# EAGLE design paintboard (EAGLE 6.4)
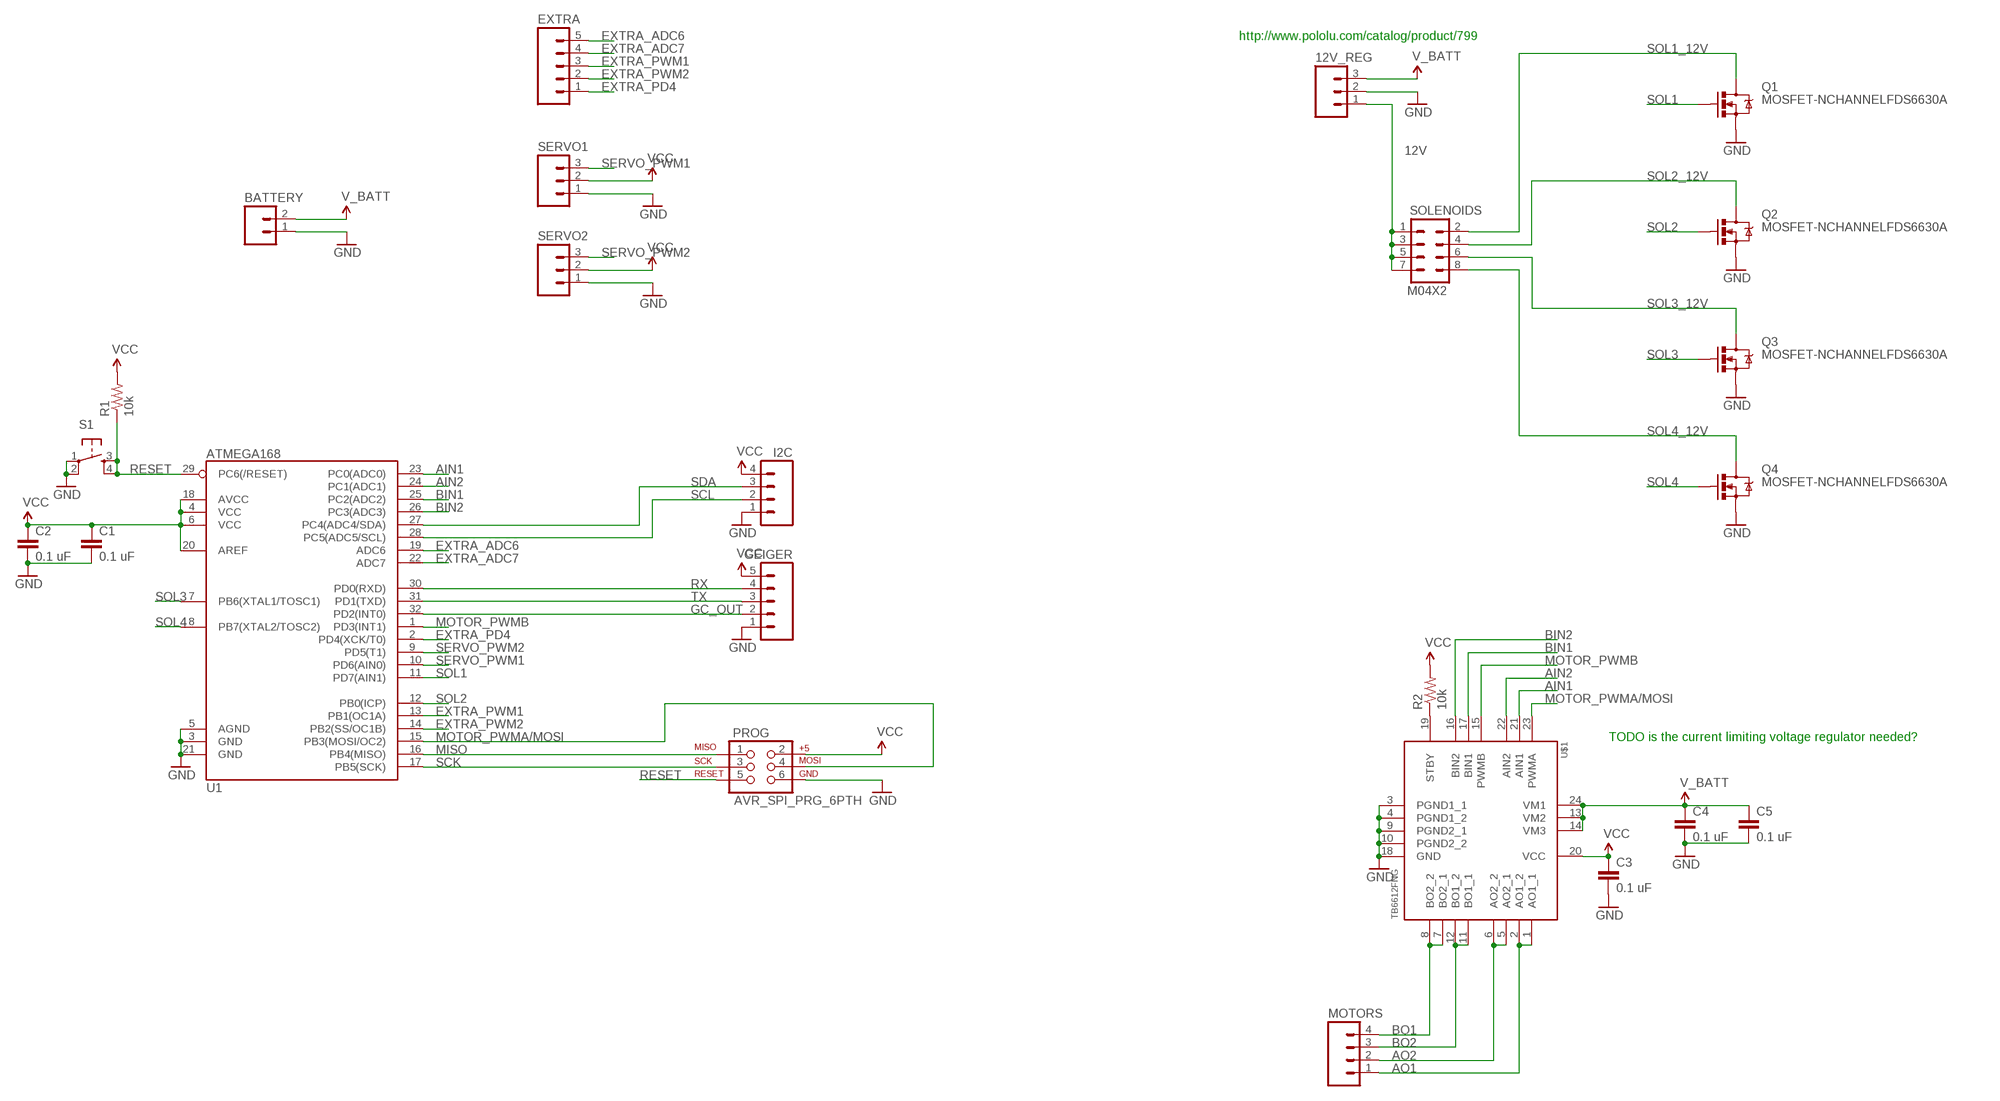
[diagram p0: schematic, sheet 1]

## Parts
12V_REG  M03PTH  [1X03]
BATTERY  M02PTH  [1X02]
C1  0.1 uF  CAP0805  [0805]
C2  0.1 uF  CAP0805  [0805]
C3  0.1 uF  CAP0805  [0805]
C4  0.1 uF  CAP0805  [0805]
C5  0.1 uF  CAP0805  [0805]
EXTRA  M05PTH  [1X05]
GEIGER  M05PTH  [1X05]
I2C  M04PTH  [1X04]
MOTORS  M04PTH  [1X04]
PROG  AVR_SPI_PRG_6PTH  [2X3]
Q1  MOSFET-NCHANNELFDS6630A  [SO08]
Q2  MOSFET-NCHANNELFDS6630A  [SO08]
Q3  MOSFET-NCHANNELFDS6630A  [SO08]
Q4  MOSFET-NCHANNELFDS6630A  [SO08]
R1  10k  RESISTOR0805-RES  [0805]
R2  10k  RESISTOR0805-RES  [0805]
S1  TAC_SWITCHSMD  [TACTILE_SWITCH_SMD]
SERVO1  M03PTH  [1X03]
SERVO2  M03PTH  [1X03]
SOLENOIDS  M04X2  [2X4]
U1  ATMEGA168  [TQFP32-08]
U$1  TB6612FNG  [24-SSOP]

## Nets
12V: 12V_REG.1 SOLENOIDS.1 SOLENOIDS.3 SOLENOIDS.5 SOLENOIDS.7
AIN1: U1.23(PC0(ADC0)) U$1.21(AIN1)
AIN2: U1.24(PC1(ADC1)) U$1.22(AIN2)
AO1: MOTORS.1 U$1.1(AO1_1) U$1.2(AO1_2)
AO2: MOTORS.2 U$1.5(AO2_1) U$1.6(AO2_2)
BIN1: U1.25(PC2(ADC2)) U$1.17(BIN1)
BIN2: U1.26(PC3(ADC3)) U$1.16(BIN2)
BO1: MOTORS.4 U$1.7(BO2_1) U$1.8(BO2_2)
BO2: MOTORS.3 U$1.11(BO1_1) U$1.12(BO1_2)
EXTRA_ADC6: EXTRA.5 U1.19(ADC6)
EXTRA_ADC7: EXTRA.4 U1.22(ADC7)
EXTRA_PD4: EXTRA.1 U1.2(PD4(XCK/T0))
EXTRA_PWM1: EXTRA.3 U1.13(PB1(OC1A))
EXTRA_PWM2: EXTRA.2 U1.14(PB2(SS/OC1B))
GC_OUT: GEIGER.2 U1.32(PD2(INT0))
GND: 12V_REG.2 BATTERY.1 C1.2 C2.2 C3.2 C4.2 C5.2 GEIGER.1 I2C.1 PROG.6 Q1.1(S) Q1.2(S) Q1.3(S) Q2.1(S) Q2.2(S) Q2.3(S) Q3.1(S) Q3.2(S) Q3.3(S) Q4.1(S) Q4.2(S) Q4.3(S) S1.1 S1.2 SERVO1.1 SERVO2.1 U1.3(GND) U1.5(AGND) U1.21(GND) U$1.3(PGND1_1) U$1.4(PGND1_2) U$1.9(PGND2_1) U$1.10(PGND2_2) U$1.18(GND)
MISO: PROG.1 U1.16(PB4(MISO))
MOTOR_PWMA/MOSI: PROG.4 U1.15(PB3(MOSI/OC2)) U$1.23(PWMA)
MOTOR_PWMB: U1.1(PD3(INT1)) U$1.15(PWMB)
N$4: R2.1 U$1.19(STBY)
RESET: PROG.5 R1.1 S1.3 S1.4 U1.29(PC6(/RESET))
RX: GEIGER.4 U1.30(PD0(RXD))
SCK: PROG.3 U1.17(PB5(SCK))
SCL: I2C.2 U1.28(PC5(ADC5/SCL))
SDA: I2C.3 U1.27(PC4(ADC4/SDA))
SERVO_PWM1: SERVO1.3 U1.10(PD6(AIN0))
SERVO_PWM2: SERVO2.3 U1.9(PD5(T1))
SOL1: Q1.4(G) U1.11(PD7(AIN1))
SOL1_12V: Q1.5(D) Q1.6(D) Q1.7(D) Q1.8(D) SOLENOIDS.2
SOL2: Q2.4(G) U1.12(PB0(ICP))
SOL2_12V: Q2.5(D) Q2.6(D) Q2.7(D) Q2.8(D) SOLENOIDS.4
SOL3: Q3.4(G) U1.7(PB6(XTAL1/TOSC1))
SOL3_12V: Q3.5(D) Q3.6(D) Q3.7(D) Q3.8(D) SOLENOIDS.6
SOL4: Q4.4(G) U1.8(PB7(XTAL2/TOSC2))
SOL4_12V: Q4.5(D) Q4.6(D) Q4.7(D) Q4.8(D) SOLENOIDS.8
TX: GEIGER.3 U1.31(PD1(TXD))
V_BATT: 12V_REG.3 BATTERY.2 C4.1 C5.1 U$1.13(VM2) U$1.14(VM3) U$1.24(VM1)
VCC: C1.1 C2.1 C3.1 GEIGER.5 I2C.4 PROG.2 R1.2 R2.2 SERVO1.2 SERVO2.2 U1.4(VCC) U1.6(VCC) U1.18(AVCC) U1.20(AREF) U$1.20(VCC)

## Notes on the sheet
- http://www.pololu.com/catalog/product/799
- TODO is the current limiting voltage regulator needed?

## Library data of the parts
12V_REG SERVO1 SERVO2 = SparkFun-Connectors:M03: Header 3 Standard 3-pin 0.1" header. Use with straight break away headers (SKU : PRT-00116), right angle break away headers (PRT-00553), swiss pins (PRT-00743), machine pins (PRT-00117), and female headers (PRT-00115). Molex polarized connector foot print use with SKU : PRT-08232 with associated crimp pins and housings.
BATTERY = SparkFun-Connectors:M02: Header 2 Standard 2-pin 0.1" header. Use with straight break away headers (SKU : PRT-00116), right angle break away headers (PRT-00553), swiss pins (PRT-00743), machine pins (PRT-00117), and female headers (PRT-00115). Molex polarized connector foot print use with SKU : PRT-08233 with associated crimp pins and housings.
C1-C5 = SparkFun-Passives:CAP: Capacitor Standard 0603 ceramic capacitor, and 0.1" leaded capacitor.
EXTRA GEIGER = SparkFun-Connectors:M05: Header 5 Standard 5-pin 0.1" header. Use with straight break away headers (SKU : PRT-00116), right angle break away headers (PRT-00553), swiss pins (PRT-00743), machine pins (PRT-00117), and female headers (PRT-00115). Molex polarized connector foot print use with SKU : PRT-08230 with associated crimp pins and housings.
I2C MOTORS = SparkFun-Connectors:M04: Header 4 Standard 4-pin 0.1" header. Use with straight break away headers (SKU : PRT-00116), right angle break away headers (PRT-00553), swiss pins (PRT-00743), machine pins (PRT-00117), and female headers (PRT-00115). Molex polarized connector foot print use with SKU : PRT-08231 with associated crimp pins and housings. 1MM SMD Version SKU: PRT-10208
PROG = SparkFun-Connectors:AVR_SPI_PRG_6: AVR ISP 6 Pin This is the reduced ISP connector for AVR programming. Common on Arduino. This footprint will take up less PCB space and can be used with a 10-pin to 6-pin adapter such as SKU: BOB-08508
Q1-Q4 = SparkFun-DiscreteSemi:MOSFET-NCHANNEL: Common NMOSFET Parts MFG P/N Store ID Prod ID FDD8780 TRANS-09984 SI7820DN TRANS-11055 FDS6630A IC-08089 2N7002PW TRANS-11151 FQP30N06L COM-10213 TRANS-10060 BSS123LT1G TRANS-08345 BSS138 TRANS-00830 BS170 2N7000; PROD_ID: IC-08089
R1 R2 = SparkFun-Passives:RESISTOR: Resistor Basic schematic elements and footprints for 0603, 1206, and PTH resistors.
S1 = SparkFun-Electromechanical:TAC_SWITCH: Momentary Switch Button commonly used for reset or general input. Spark Fun Electronics SKU : COM-00097 SMT- SWCH-08247; PROD_ID: SWCH-08247
SOLENOIDS = SparkFun-Connectors:M04X2: .1" header, two rows of four.
U1 = SparkFun-DigitalIC:ATMEGA168: Atmel 32-pin 8-bit micro, 16k flash.
U$1 = kwoo:TB6612FNG

## Board
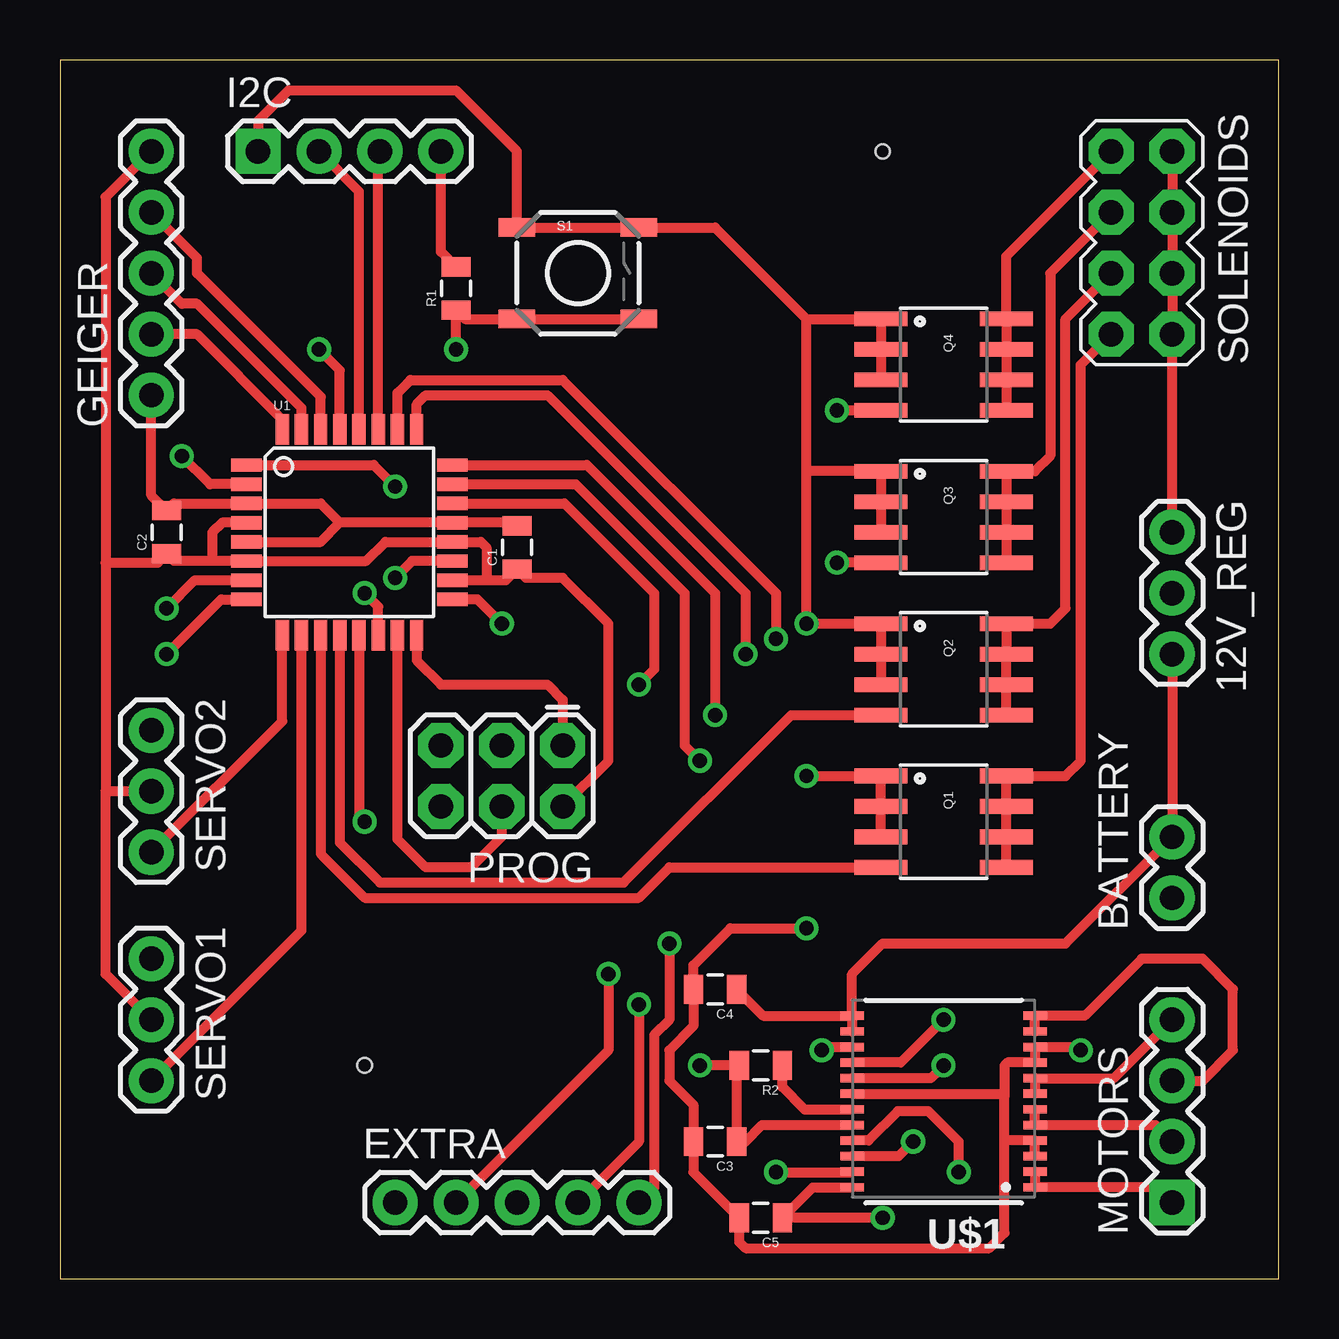
[diagram p1: board, top side]
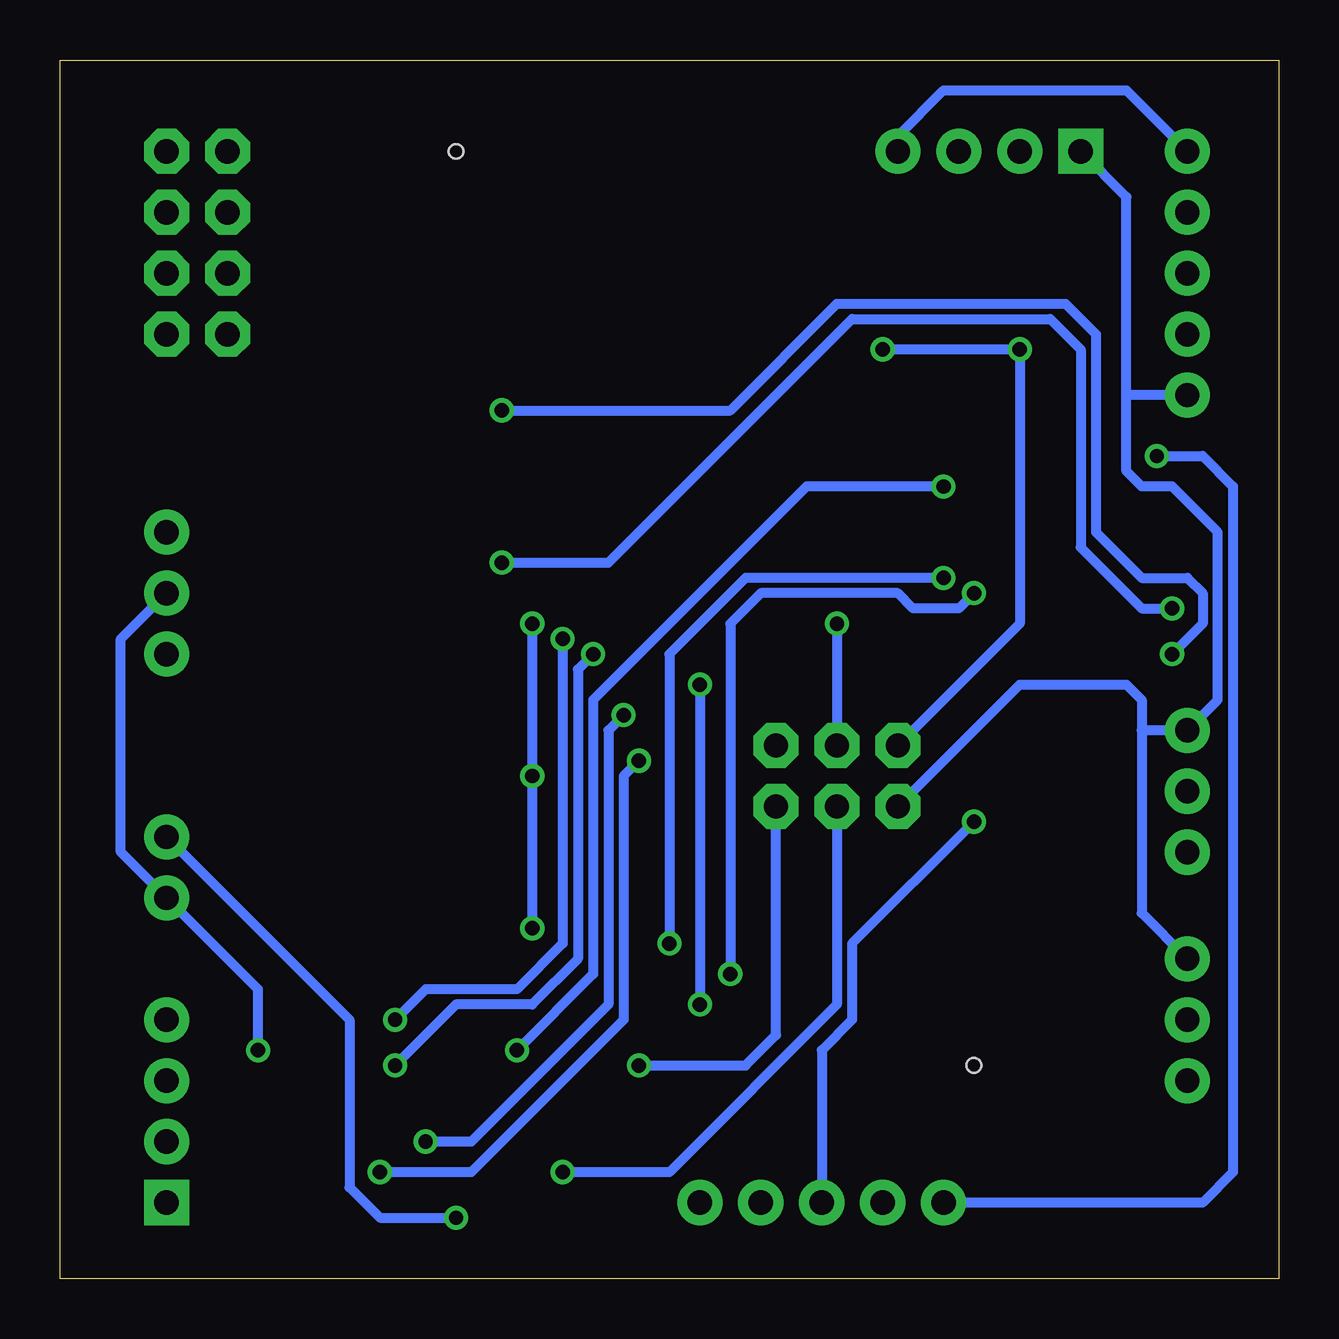
[diagram p2: board, bottom side, seen from below]

Size 50.8 x 50.8 mm. Coordinates in mm from the lower left corner, seen from the top.
Outline: 0,0 50.8,0 50.8,50.8 0,50.79 0,0
Copper layers (1*16): Top 0.035mm / dielectric 1.5mm / Bottom 0.035mm
Design rules "default *": minimum track width 10mil, minimum drill 24mil, track to track 8mil, track to pad 8mil, pad to pad 8mil, via to via 8mil, smd to smd 8mil, copper to edge 40mil, drill to drill 8mil, minimum pad ring 10mil, minimum via ring 8mil, stop-mask expansion 4mil, vias tented up to drill 0mil, thermal gap 10mil
Holes 0.6 mm at 34.29,46.99 12.7,8.89

### Footprints (pad centres in the part's own frame; a part is rotated, then mirrored left to right if it is on the bottom)
1X03 = drill 1.016 pad 1.88: 1 0,0; 2 2.54,0; 3 5.08,0
1X02 = drill 1.016 pad 1.88: 1 0,0; 2 2.54,0
0805 = smd 0.8 x 1.2: 1 -0.9,0; 2 0.9,0
1X05 = drill 1.016 pad 1.88: 1 0,0; 2 2.54,0; 3 5.08,0; 4 7.62,0; 5 10.16,0
1X04 = drill 1.016 pad 1.88 square: 1 0,0 | drill 1.016 pad 1.88: 2 2.54,0; 3 5.08,0; 4 7.62,0
2X3 = drill 1.016 pad 1.88 octagon: 1 0,0; 2 0,2.54; 3 2.54,0; 4 2.54,2.54; 5 5.08,0; 6 5.08,2.54
SO08 = smd 0.61 x 2.21: 1 -1.905,-2.616; 2 -0.635,-2.616; 3 0.635,-2.616; 4 1.905,-2.616; 5 1.905,2.616; 6 0.635,2.616; 7 -0.635,2.616; 8 -1.905,2.616
TACTILE_SWITCH_SMD = smd 1.524 x 0.762: 1 -2.54,1.905; 2 2.54,1.905; 3 -2.54,-1.905; 4 2.54,-1.905
2X4 = drill 1.016 pad 1.88 octagon: 1 -3.81,-1.27; 2 -3.81,1.27; 3 -1.27,-1.27; 4 -1.27,1.27; 5 1.27,-1.27; 6 1.27,1.27; 7 3.81,-1.27; 8 3.81,1.27
TQFP32-08 = smd 1.27 x 0.559: 1 -4.293,2.8; 2 -4.293,2; 3 -4.293,1.2; 4 -4.293,0.4; 5 -4.293,-0.4; 6 -4.293,-1.2; 7 -4.293,-2; 8 -4.293,-2.8; 17 4.293,-2.8; 18 4.293,-2; 19 4.293,-1.2; 20 4.293,-0.4; 21 4.293,0.4; 22 4.293,1.2; 23 4.293,2; 24 4.293,2.8 | smd 0.559 x 1.27: 9 -2.8,-4.293; 10 -2,-4.293; 11 -1.2,-4.293; 12 -0.4,-4.293; 13 0.4,-4.293; 14 1.2,-4.293; 15 2,-4.293; 16 2.8,-4.293; 25 2.8,4.293; 26 2,4.293; 27 1.2,4.293; 28 0.4,4.293; 29 -0.4,4.293; 30 -1.2,4.293; 31 -2,4.293; 32 -2.8,4.293
24-SSOP = smd 0.35 x 0.97: 1 0,-3.81; 2 0.65,-3.81; 3 1.3,-3.81; 4 1.95,-3.81; 5 2.6,-3.81; 6 3.25,-3.81; 7 3.9,-3.81; 8 4.55,-3.81; 9 5.2,-3.81; 10 5.85,-3.81; 11 6.5,-3.81; 12 7.15,-3.81; 13 7.15,3.81; 14 6.5,3.81; 15 5.85,3.81; 16 5.2,3.81; 17 4.55,3.81; 18 3.9,3.81; 19 3.25,3.81; 20 2.6,3.81; 21 1.95,3.81; 22 1.3,3.81; 23 0.65,3.81; 24 0,3.81

### Placement (x,y rotation side)
12V_REG  46.35,31.11 270 top
BATTERY  46.35,15.88 90 top
C1  19.05,30.48 90 top
C2  4.45,31.11 90 top
C3  27.3,5.71 180 top
C4  27.3,12.06 180 top
C5  29.21,2.54 180 top
EXTRA  13.97,3.17 0 top
GEIGER  3.81,36.83 90 top
I2C  8.26,46.99 0 top
MOTORS  46.35,3.17 90 top
PROG  20.95,22.23 180 top
Q1  36.83,19.05 270 top
Q2  36.83,25.4 270 top
Q3  36.83,31.75 270 top
Q4  36.83,38.1 270 top
R1  16.51,41.27 90 top
R2  29.21,8.89 180 top
S1  21.59,41.91 0 top
SERVO1  3.81,13.34 270 top
SERVO2  3.81,22.86 270 top
SOLENOIDS  45.09,43.18 90 top
U1  12.06,31.11 0 top
U$1  36.83,3.81 90 top

### Tracks (layer width: path | path; a pad name or v marks a point on that pad's centre or on a via)
12V
  Top 0.406: SOLENOIDS.7 SOLENOIDS.5 SOLENOIDS.3 SOLENOIDS.1 12V_REG.1
AIN1  (via drill 0.6)
  Top 0.406: U1.23 21.5,33.12 26.04,28.57 26.04,22.23 v26.67,21.59 | v37.47,4.45 37.47,5.71 36.2,6.99 34.92,6.99 33.7,5.76 U$1.21
  Bottom 0.406: v26.67,21.59 27.3,20.95 27.3,10.79 33.66,4.45 v37.47,4.45
AIN2  (via drill 0.6)
  Top 0.406: U1.24 21.96,33.91 27.3,28.57 v27.3,23.5 | v35.56,5.71 34.95,5.11 U$1.22
  Bottom 0.406: v27.3,23.5 27.94,22.86 27.94,11.43 33.66,5.71 v35.56,5.71
AO1
  Top 0.406: U$1.2 U$1.1 45.72,3.81 MOTORS.1
AO2
  Top 0.406: MOTORS.2 45.66,6.41 U$1.5 U$1.6
BIN1  (via drill 0.6)
  Top 0.406: U1.25 14.87,36.45 15.24,36.83 20.32,36.83 28.57,28.57 v28.57,26.04 | v36.83,8.89 36.3,8.36 U$1.17
  Bottom 0.406: v28.57,26.04 29.21,25.4 29.21,13.34 31.11,11.43 34.29,11.43 v36.83,8.89
BIN2  (via drill 0.6)
  Top 0.406: U1.26 14.06,36.92 14.61,37.47 20.95,37.47 29.84,28.57 v29.84,26.67 | v36.83,10.79 35.05,9.01 U$1.16
  Bottom 0.406: v29.84,26.67 29.84,13.97 31.75,12.06 35.56,12.06 v36.83,10.79
BO1
  Top 0.406: U$1.7 U$1.8 43.92,8.36 MOTORS.4
BO2
  Top 0.406: U$1.11 U$1.12 42.71,10.96 45.09,13.34 47.62,13.34 48.9,12.06 48.9,9.53 47.62,8.26 MOTORS.3
EXTRA_ADC6  (via drill 0.6)
  Top 0.406: U1.19 14.68,29.91 v13.97,29.21 | v25.4,13.97 25.4,10.79 24.77,10.16 24.77,3.81 EXTRA.5
  Bottom 0.406: v13.97,29.21 22.23,29.21 25.4,26.04 v25.4,13.97
EXTRA_ADC7  (via drill 0.6)
  Top 0.406: U1.22 21.02,32.31 24.77,28.57 24.77,25.4 v24.13,24.77 | v24.13,11.43 24.13,5.71 EXTRA.4
  Bottom 0.406: v24.13,24.77 v24.13,11.43
EXTRA_PD4  (via drill 0.6)
  Top 0.406: U1.2 6.25,33.12 v5.08,34.29
  Bottom 0.406: v5.08,34.29 3.17,34.29 1.91,33.02 1.91,4.45 3.17,3.17 EXTRA.1
EXTRA_PWM1  (via drill 0.6)
  Top 0.406: U1.13 12.46,19.29 v12.7,19.05
  Bottom 0.406: v12.7,19.05 17.78,13.97 17.78,10.79 19.05,9.53 EXTRA.3
EXTRA_PWM2  (via drill 0.6)
  Top 0.406: v22.86,12.7 22.86,9.53 EXTRA.2 | U1.14 13.27,28.01 v12.7,28.57
  Bottom 0.406: v22.86,12.7 22.86,27.3 21.59,28.57 15.88,28.57 15.24,27.94 13.34,27.94 v12.7,28.57
GC_OUT
  Top 0.406: U1.32 9.27,35.82 5.71,39.37 GEIGER.2
GND  (via drill 0.6)
  Top 0.406: 11.66,31.52 10.87,32.31 U1.3 4.75,32.31 C2.2 3.81,32.65 GEIGER.1 | 11.66,31.52 U1.21 18.91,31.52 C1.2 | U1.5 10.87,30.71 11.66,31.52 | Q4.3 Q4.2 Q4.1 31.11,40.01 | Q1.3 Q1.2 Q1.1 v31.11,20.95 | Q3.3 Q3.2 Q3.1 31.11,33.66 | Q2.3 Q2.2 Q2.1 v31.11,27.3 31.11,33.66 | I2C.1 8.26,48.26 9.53,49.53 16.51,49.53 19.05,46.99 S1.1 S1.2 27.3,43.81 31.11,40.01 | U$1.3 U$1.4 39.41,5.76 39.37,5.71 | v31.11,14.61 27.94,14.61 26.41,13.07 C4.2 26.41,10.53 25.4,9.53 25.4,8.26 26.41,7.25 C3.2 26.41,4.45 C5.2 28.31,1.53 28.57,1.27 38.73,1.27 39.37,1.91 39.37,5.71 | 31.11,33.66 31.11,40.01 | 39.37,7.62 39.37,8.89 39.49,9.01 U$1.9 U$1.10 42.41,9.66 v42.55,9.53 | U$1.18 39.28,7.71 39.37,7.62 | 39.37,5.71 39.37,7.62
  Bottom 0.406: v31.11,27.3 v31.11,20.95 v31.11,14.61 | GEIGER.1 6.35,36.83 | 6.35,36.83 6.35,33.66 5.71,33.02 4.45,33.02 2.54,31.11 2.54,24.13 SERVO2.1 5.71,22.86 | 6.35,36.83 6.35,45.09 I2C.1 | PROG.6 10.79,24.77 6.35,24.77 5.71,24.13 5.71,22.86 | SERVO1.1 5.71,15.24 5.71,22.86 | v42.55,9.53 42.55,12.06 BATTERY.1 48.26,17.78 48.26,26.67 12V_REG.2
MISO
  Top 0.406: U1.16 14.87,25.77 15.88,24.77 20.32,24.77 20.95,24.13 PROG.1
MOTOR_PWMA/MOSI  (via drill 0.6)
  Top 0.406: PROG.4 18.41,18.41 17.14,17.14 15.24,17.14 14.06,18.32 U1.15 | v29.84,4.45 33.01,4.45 U$1.23
  Bottom 0.406: PROG.4 18.41,11.43 25.4,4.45 v29.84,4.45
MOTOR_PWMB  (via drill 0.6)
  Top 0.406: U1.1 13.07,33.91 v13.97,33.02 | v31.75,9.53 31.89,9.66 U$1.15
  Bottom 0.406: v13.97,33.02 19.68,33.02 28.57,24.13 28.57,12.7 v31.75,9.53
N$4
  Top 0.406: U$1.19 31.04,7.06 30.11,7.99 R2.1
RESET  (via drill 0.6)
  Top 0.406: U1.29 11.66,37.87 v10.79,38.73 | v16.51,38.73 R1.1 16.88,40.01 S1.3 S1.4
  Bottom 0.406: v16.51,38.73 v10.79,38.73 10.79,27.3 PROG.5
RX
  Top 0.406: U1.30 10.87,36.76 5.71,41.91 5.71,42.55 GEIGER.4
SCK  (via drill 0.6)
  Top 0.406: v18.41,27.3 17.41,28.32 U1.17
  Bottom 0.406: v18.41,27.3 PROG.3
SCL
  Top 0.406: U1.28 12.46,45.32 I2C.2
SDA
  Top 0.406: U1.27 13.27,46.92 I2C.3
SERVO_PWM1
  Top 0.406: SERVO1.3 10.06,14.51 U1.10
SERVO_PWM2
  Top 0.406: SERVO2.3 9.27,23.23 U1.9
SOL1
  Top 0.406: U1.11 10.87,17.71 12.7,15.88 24.13,15.88 25.4,17.14 Q1.4
SOL1_12V
  Top 0.406: Q1.5 Q1.6 Q1.7 Q1.8 41.91,20.95 42.55,21.59 42.55,38.1 SOLENOIDS.2
SOL2
  Top 0.406: U1.12 11.66,18.18 13.34,16.51 23.5,16.51 30.48,23.5 Q2.4
SOL2_12V
  Top 0.406: Q2.5 Q2.6 Q2.7 Q2.8 41.27,27.3 41.91,27.94 41.91,40.01 SOLENOIDS.4
SOL3  (via drill 0.6)
  Top 0.406: Q3.4 v32.38,29.84 | v4.45,27.94 5.62,29.11 U1.7
  Bottom 0.406: v32.38,29.84 27.94,29.84 17.78,40.01 9.53,40.01 8.26,38.73 8.26,30.48 5.71,27.94 v4.45,27.94
SOL3_12V
  Top 0.406: Q3.5 Q3.6 Q3.7 Q3.8 40.64,33.66 41.27,34.29 41.27,41.91 SOLENOIDS.6
SOL4  (via drill 0.6)
  Top 0.406: Q4.4 v32.38,36.2 | v4.45,26.04 6.72,28.32 U1.8
  Bottom 0.406: v32.38,36.2 22.86,36.2 18.41,40.64 8.89,40.64 7.62,39.37 7.62,31.11 5.71,29.21 3.81,29.21 3.17,28.57 3.17,27.3 v4.45,26.04
SOL4_12V
  Top 0.406: Q4.5 Q4.6 Q4.7 Q4.8 39.45,42.62 SOLENOIDS.8
TX
  Top 0.406: U1.31 10.06,36.29 5.71,40.64 5.08,40.64 GEIGER.3
V_BATT  (via drill 0.6)
  Top 0.406: U$1.13 U$1.14 | C4.1 29.31,10.96 U$1.13 | U$1.24 31.38,3.81 C5.1 v34.29,2.54 | U$1.13 33.02,12.7 34.29,13.97 41.91,13.97 BATTERY.2 12V_REG.3
  Bottom 0.406: BATTERY.2 38.73,10.79 38.73,3.81 37.47,2.54 v34.29,2.54
VCC  (via drill 0.6)
  Top 0.406: 6.35,29.91 U1.6 12.77,29.91 13.57,30.71 U1.20 17.55,30.71 17.78,30.48 17.78,29.11 | 6.35,29.91 4.75,29.91 C2.1 4.08,29.84 1.91,29.84 | U1.4 6.75,31.52 6.35,31.11 6.35,29.91 | U1.18 17.78,29.11 | 17.78,29.11 18.59,29.11 C1.1 19.42,29.21 20.95,29.21 22.86,27.3 22.86,21.59 PROG.2 | U$1.20 29.27,6.41 28.57,5.71 C3.1 28.2,8.79 R2.2 v26.67,8.89 | R1.2 15.88,42.81 I2C.4 | SERVO1.2 1.91,12.7 1.91,20.32 | SERVO2.2 1.91,20.32 | GEIGER.5 1.91,45.09 1.91,29.84 | 1.91,29.84 1.91,20.32
  Bottom 0.406: I2C.4 15.88,47.62 13.97,49.53 6.35,49.53 GEIGER.5 | v26.67,8.89 22.23,8.89 20.95,10.16 PROG.2